# Altium schematic sheet UWB_V1.SchDoc
size B
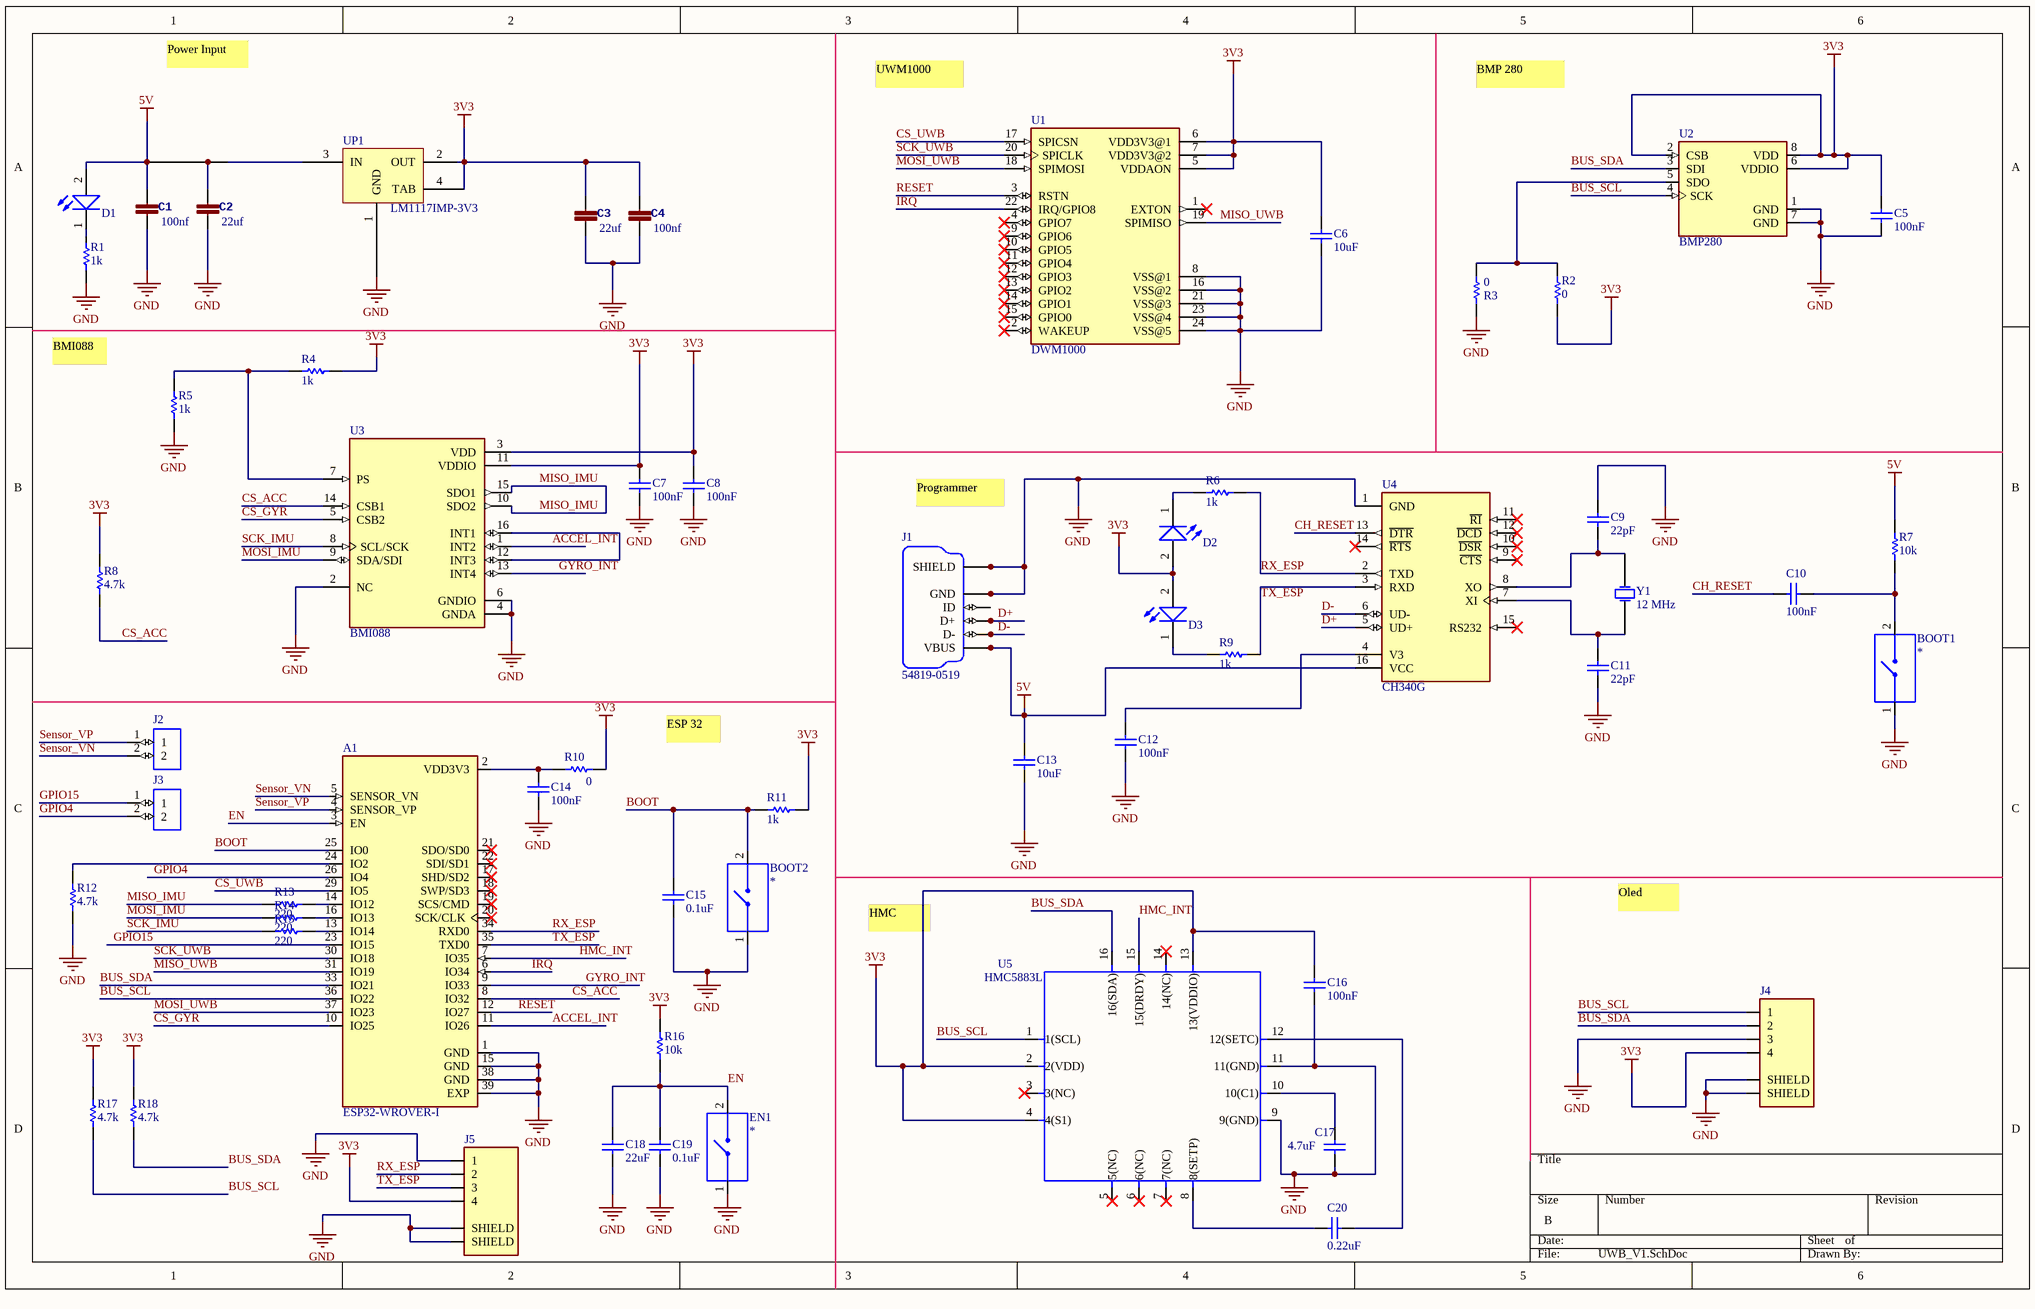
[diagram p0: UWB_V1.SchDoc]

## Parts
A1  ESP32-WROVER-I  [XCVR_ESP32-WROVER-I]
BOOT1  1437566-4  [SW_TS09-63-25-R-160-SMT-TR]  (value not drawn)
BOOT2  1437566-4  [SW_TS09-63-25-R-160-SMT-TR]  (value not drawn)
C1  value 100nf  [C_805]  (hidden comment: Cap)
C2  value 22uf  [C_805]  (hidden comment: Cap)
C3  value 22uf  [C_805]  (hidden comment: Cap)
C4  value 100nf  [C_805]  (hidden comment: Cap)
C5  100nF  [C_805]
C6  10uF  [Tantalum_B]
C7  100nF  [C_805]
C8  100nF  [C_805]
C9  22pF  [C_805]
C10  100nF  [C_805]
C11  22pF  [C_805]
C12  100nF  [C_805]
C13  10uF  [Tantalum_B]
C14  100nF  [C_805]
C15  0.1uF  [C_805]
C16  100nF  [C_805]
C17  4.7uF  [C_805]
C18  22uF  [C_805]
C19  0.1uF  [C_805]
C20  0.22uF  [C_805]
D1  LED SMD PACKAGE  [LED_V0805-SMD-R (Red)]  (value not drawn)
D2  LED SMD PACKAGE  [LED_V0805-SMD-R (Red)]  (value not drawn)
D3  LED SMD PACKAGE  [LED_V0805-SMD-R (Red)]  (value not drawn)
EN1  1437566-4  [SW_TS09-63-25-R-160-SMT-TR]  (value not drawn)
J1  54819-0519  [MOLEX_54819-0519]
J2  (no value)  [SM02B-SRSS-TB(LF)(SN)]
J3  (no value)  [SM02B-SRSS-TB(LF)(SN)]
J4  (no value)  [JST_SM04B-SRSS-TB(LF)(SN)]
J5  (no value)  [JST_SM04B-SRSS-TB(LF)(SN)]
R1  value 1k  [R_805]  (hidden comment: Resistor SMD 0603)
R2  value 0  [R_805]  (hidden comment: Resistor SMD 0603)
R3  value 0  [R_805]  (hidden comment: Resistor SMD 0603)
R4  value 1k  [R_805]  (hidden comment: Resistor SMD 0603)
R5  value 1k  [R_805]  (hidden comment: Resistor SMD 0603)
R6  value 1k  [R_805]  (hidden comment: Resistor SMD 0603)
R7  value 10k  [R_805]  (hidden comment: Resistor SMD 0603)
R8  value 4.7k  [R_805]  (hidden comment: Resistor SMD 0603)
R9  value 1k  [R_805]  (hidden comment: Resistor SMD 0603)
R10  value 0  [R_805]  (hidden comment: Resistor SMD 0603)
R11  value 1k  [R_805]  (hidden comment: Resistor SMD 0603)
R12  value 4.7k  [R_805]  (hidden comment: Resistor SMD 0603)
R13  value 220  [R_805]  (hidden comment: Resistor SMD 0603)
R14  value 220  [R_805]  (hidden comment: Resistor SMD 0603)
R15  value 220  [R_805]  (hidden comment: Resistor SMD 0603)
R16  value 10k  [R_805]  (hidden comment: Resistor SMD 0603)
R17  value 4.7k  [R_805]  (hidden comment: Resistor SMD 0603)
R18  value 4.7k  [R_805]  (hidden comment: Resistor SMD 0603)
U1  DWM1000  [XCVR_DWM1000]
U2  BMP280  [XDCR_BMP280]
U3  BMI088  [PQFN50P450X300X100-16N]
U4  CH340G  [SOIC127P600X180-16N]
U5  HMC5883L  [PLCC16-0.5-3X3MM]
UP1  LM1117IMP-3V3  [SOT223_4]
Y1  12 MHz  [Crystal SMD]

## Nets
3V3: C3.1 C4.1 C5.2 C6.2 C7.2 C8.2 C16.2 D2.2(A) D3.2(A) J4.4 J5.4 R2.2 R4.1 R8.2 R10.2 R11.1 R16.1 R17.2 R18.2 U1.5(VDDAON) U1.6(VDD3V3@1) U1.7(VDD3V3@2) U2.2(CSB) U2.6(VDDIO) U2.8(VDD) U3.3(VDD) U3.11(VDDIO) U5.2(2(VDD)) U5.4(4(S1)) U5.13(13(VDDIO)) UP1.2(OUT) UP1.4(TAB)
5V: C1.1 C2.1 C13.2 D1.2(A) J1.1(VBUS) J1.6(VBUS) R7.1 U4.16(VCC) UP1.3(IN)
GND: A1.1(GND) A1.15(GND) A1.38(GND) A1.39(EXP) BOOT1.1 BOOT2.1 C1.2 C2.2 C3.2 C4.2 C5.1 C6.1 C7.1 C8.1 C9.1 C11.2 C12.2 C13.1 C14.1 C15.1 C16.1 C17.2 C18.1 C19.1 EN1.1 J1.5(GND) J1.10(GND) J1.11(SHIELD) J1.12(SHIELD) J1.S1(SHIELD) J1.S2(SHIELD) J4.3 J4.S1(SHIELD) J4.S2(SHIELD) J5.1 J5.S1(SHIELD) J5.S2(SHIELD) R1.1 R3.2 R5.1 R12.1 U1.8(VSS@1) U1.16(VSS@2) U1.21(VSS@3) U1.23(VSS@4) U1.24(VSS@5) U2.1(GND) U2.7(GND) U3.2(NC) U3.4(GNDA) U3.6(GNDIO) U4.1(GND) U5.9(9(GND)) U5.11(11(GND)) UP1.1(GND)
ACCEL_INT: A1.11(IO26) U3.1(INT2)
BOOT: A1.25(IO0) BOOT2.2 C15.2 R11.2
BUS_SCL: A1.36(IO22) J4.1 R17.1 U2.4(SCK) U5.1(1(SCL))
BUS_SDA: A1.33(IO21) J4.2 R18.1 U2.3(SDI) U5.16(16(SDA))
CH_RESET: C10.2 U4.13(~{DTR})
CS_ACC: A1.8(IO32) R8.1 U3.14(CSB1)
CS_GYR: A1.10(IO25) U3.5(CSB2)
CS_UWB: A1.29(IO5) U1.17(SPICSN)
D+: J1.3(D+) J1.8(D+) U4.5(UD+)
D-: J1.2(D-) J1.7(D-) U4.6(UD-)
EN: A1.3(EN) C18.2 C19.2 EN1.2 R16.2
GPIO4: A1.26(IO4) J3.2
GPIO15: A1.23(IO15) J3.1
GYRO_INT: A1.9(IO33) U3.13(INT4)
HMC_INT: A1.7(IO35) U5.15(15(DRDY))
IRQ: A1.6(IO34) U1.22(IRQ/GPIO8)
MISO_IMU: R13.2 U3.10(SDO2) U3.15(SDO1)
MISO_UWB: A1.31(IO19) U1.19(SPIMISO)
MOSI_IMU: R14.2 U3.9(SDA/SDI)
MOSI_UWB: A1.37(IO23) U1.18(SPIMOSI)
RESET: A1.12(IO27) U1.3(RSTN)
RX_ESP: A1.34(RXD0) J5.2 R6.2 U4.2(TXD)
SCK_IMU: R15.2 U3.8(SCL/SCK)
SCK_UWB: A1.30(IO18) U1.20(SPICLK)
Sensor_VN: A1.5(SENSOR_VN) J2.2
Sensor_VP: A1.4(SENSOR_VP) J2.1
TX_ESP: A1.35(TXD0) J5.3 R9.2 U4.3(RXD)
NetA1_2: A1.2(VDD3V3) C14.2 R10.1
NetA1_13: A1.13(IO14) R15.1
NetA1_14: A1.14(IO12) R13.1
NetA1_16: A1.16(IO13) R14.1
NetA1_24: A1.24(IO2) R12.2
NetBOOT1_2: BOOT1.2 C10.1 R7.2
NetC9_2: C9.2 U4.8(XO) Y1.2(OSC2)
NetC11_1: C11.1 U4.7(XI) Y1.1(OSC1)
NetC12_1: C12.1 U4.4(V3)
NetC17_1: C17.1 U5.10(10(C1))
NetC20_1: C20.1 U5.12(12(SETC))
NetC20_2: C20.2 U5.8(8(SETP))
NetD1_1: D1.1(K) R1.2
NetD2_1: D2.1(K) R6.1
NetD3_1: D3.1(K) R9.1
NetJ1_4: J1.4(ID) J1.9(ID)
NetR2_1: R2.1 R3.1 U2.5(SDO)
NetR4_2: R4.2 R5.2 U3.7(PS)
NetU3_12: U3.12(INT3) U3.16(INT1)

Not connected (* = marked no-connect by the designer): A1 17(SHD/SD2)* 18(SWP/SD3)* 19(SCS/CMD)* 20(SCK/CLK)* 21(SDO/SD0)* 22(SDI/SD1)*; U1 1(EXTON)* 2(WAKEUP)* 4(GPIO7)* 9(GPIO6)* 10(GPIO5)* 11(GPIO4)* 12(GPIO3)* 13(GPIO2)* 14(GPIO1)* 15(GPIO0)*; U4 9(~{CTS})* 10(~{DSR})* 11(~{RI})* 12(~{DCD})* 14(~{RTS})* 15(RS232)*; U5 3(3(NC))* 5(5(NC))* 6(6(NC))* 7(7(NC))* 14(14(NC))*

## Notes on the sheet
- Power Input
- UWM1000
- BMP 280
- BMI088
- Programmer
- ESP 32
- Oled
- HMC

## Library data of the parts
A1 = ESP32-WROVER-I: Module: combo; GPIO, I2C x2, I2S x2, SDIO, SPI x3, UART x3; U.FL; Price: None; MP: ESP32-WROVER-I; Value: *; Availability: Unavailable; Package: None
BOOT1 BOOT2 EN1 = 1437566-4: Switch Tactile OFF _ON_ SPST Rectangular Button Gull Wing 0.05A 12VDC 1.77N SMD T/R; MF: TE Connectivity; Configuration_Pole-Throw: Single Pole - Single Throw; Contact_Current_Rating: 50 mA; MP: FSMSMTR; Package: None; Digi-Key_Part_Number: 450-1758-1-ND; Digi-Key_Purchase_URL: https://www.digikey.com/product-detail/en/te-connectivity-alcoswitch-switches/FSMSMTR/450-1758-1-ND/2271637?utm_source=snapeda&utm_medium=aggregator&utm_campaign=symbol; Value: *; TE_purchase_URL: https://www.te.com/usa-en/product-1437566-4.html?te_bu=Cor&te_type=disp&te_campaign=seda_glo_cor-seda-global-disp-prtnr-fy19-seda-model-bom-cta_sma-317_1&elqCampaignId=32493; SnapEDA_Link: https://www.snapeda.com/parts/FSMSMTR/TE%20Connectivity%20ALCOSWITCH%20Switches/view-part/2118497/?ref=snap; Comment_1: *
C1-C4 = Cap_1
C5-C20 = CAP SMD 0805: CAP 0805; Designer: Abbas Basereh; Desc.: CAP SMD 0805; Data: 16-12-2016
D1-D3 = LED SMD PACKAGE: SMD Mono-color Chip LED Waterclear; Part Number: 150080BS75000; Peak Wavelength: 465 nm; Forward Voltage: 3.2 V; Published Date: Jan 2017; Publisher: Ali Hafizi
J1 = 54819-0519: USB - mini B USB 2.0 OTG Receptacle Connector 5 Position Through Hole, Right Angle; MF: Molex; Availability: Good; MP: 54819-0519; Purchase-URL: https://pricing.snapeda.com/search/part/54819-0519/?ref=eda; Value: *; Check_prices: https://www.snapeda.com/parts/54819-0519/Molex/view-part/13744/?ref=eda; SnapEDA_Link: https://www.snapeda.com/parts/54819-0519/Molex/view-part/13744/?ref=snap; Price: None; Package: None
J2 J3 = SM02B-SRSS-TB(LF)(SN): Connector Header Surface Mount, Right Angle 2 position 0.039 _1.00mm_; MP: SM02B-SRSS-TB_LF__SN_; MF: JST Sales; SnapEDA_Link: https://www.snapeda.com/parts/SM02B-SRSS-TB%28LF%29%28SN%29/JST%20Sales%20America%20Inc./view-part/447499/?ref=snap; Price: None; Value: *; Availability: Unavailable; Package: None
J4 J5 = SM04B-SRSS-TB(LF)(SN): Connector Header Surface Mount, Right Angle 4 position 0.039 _1.00mm_; MF: JST Sales; MP: SM04B-SRSS-TB_LF__SN_; Price: None; SnapEDA_Link: https://www.snapeda.com/parts/SM04B-SRSS-TB%28LF%29%28SN%29/JST%20Sales%20America%20Inc./view-part/557466/?ref=snap; Value: *; Availability: Unavailable; Package: None
U1 = DWM1000: 802.15.4 IR-UWB Transceiver Module 3.5GHz ~ 6.5GHz Integrated, Chip Surface Mount; MF: Decawave Limited; Package: Module Decawave; Availability: Unavailable; Value: *; MP: DWM1000; SnapEDA_Link: https://www.snapeda.com/parts/DWM1000/Decawave%20Limited/view-part/327593/?ref=snap; Price: None
U2 = BMP280: BMP280 Absolute Barometric Pressure Sensor for Battery Powered Devices 2 x 2.5mm; Value: *; Availability: Unavailable; Price: None; MP: BMP280; Package: None
U3 = BMI088: Accelerometer, Gyroscope, 6 Axis Sensor IÂ²C, SPI Output; MF: Bosch Sensortec; Package: VFLGA-16 Bosch Sensortec; Purchase-URL: https://pricing.snapeda.com/search/part/BMI088/?ref=eda; Value: *; MP: BMI088; Price: None; SnapEDA_Link: https://www.snapeda.com/parts/BMI088/Bosch%20Sensortec/view-part/2774026/?ref=snap; Check_prices: https://www.snapeda.com/parts/BMI088/Bosch%20Sensortec/view-part/2774026/?ref=eda; Availability: In Stock
U5 = MAGNETIC-HMC5883L(PLCC16): HMC5883L HMC Magnetic, Digital Compass Sensor Evaluation Board; MF: Honeywell Aerospace; MP: HMC5883L; Check_prices: https://www.snapeda.com/parts/HMC5883L/Honeywell%20Aerospace/view-part/106081/?ref=eda; Package: LCC-16 Honeywell; SnapEDA_Link: https://www.snapeda.com/parts/HMC5883L/Honeywell%20Aerospace/view-part/106081/?ref=snap; Value: *; Price: None; Availability: Unavailable
UP1 = LM1117IMP-x.x: x.x Volt, 800mA Low-Dropout Linear Regulator, 4-pin SOT-223; Designer: Abbas Basereh; Data: 16-12-2016; VALUE: LM1117IMP-3V3
Y1 = XTAL_Crystal: XTAL Crystal; Designer: ABBAS BASEREH; Design Date: 2017-1-3; ComponentLink1Description: Datasheet; ComponentLink2Description: Reference; Mounting Technology: Surface Mount\Through-Hole; Value: 12 MHz; Status: Unreleased
R1-R18 = Resistor SMD 0603: DatasheetVersion: 2021; ComponentLink1Description: Website: Tarahiboard; ComponentLink1URL: https://www.tarahiboard.com/; ComponentLink2Description: Telegram; ComponentLink2URL: https://t.me/tarahiboard; ComponentLink3Description: Instagram; ComponentLink3URL: https://instagram.com/tarahiboard
U4 = CH340G: Value: *; MP: CH340G; Package: None; Availability: Unavailable; Price: None